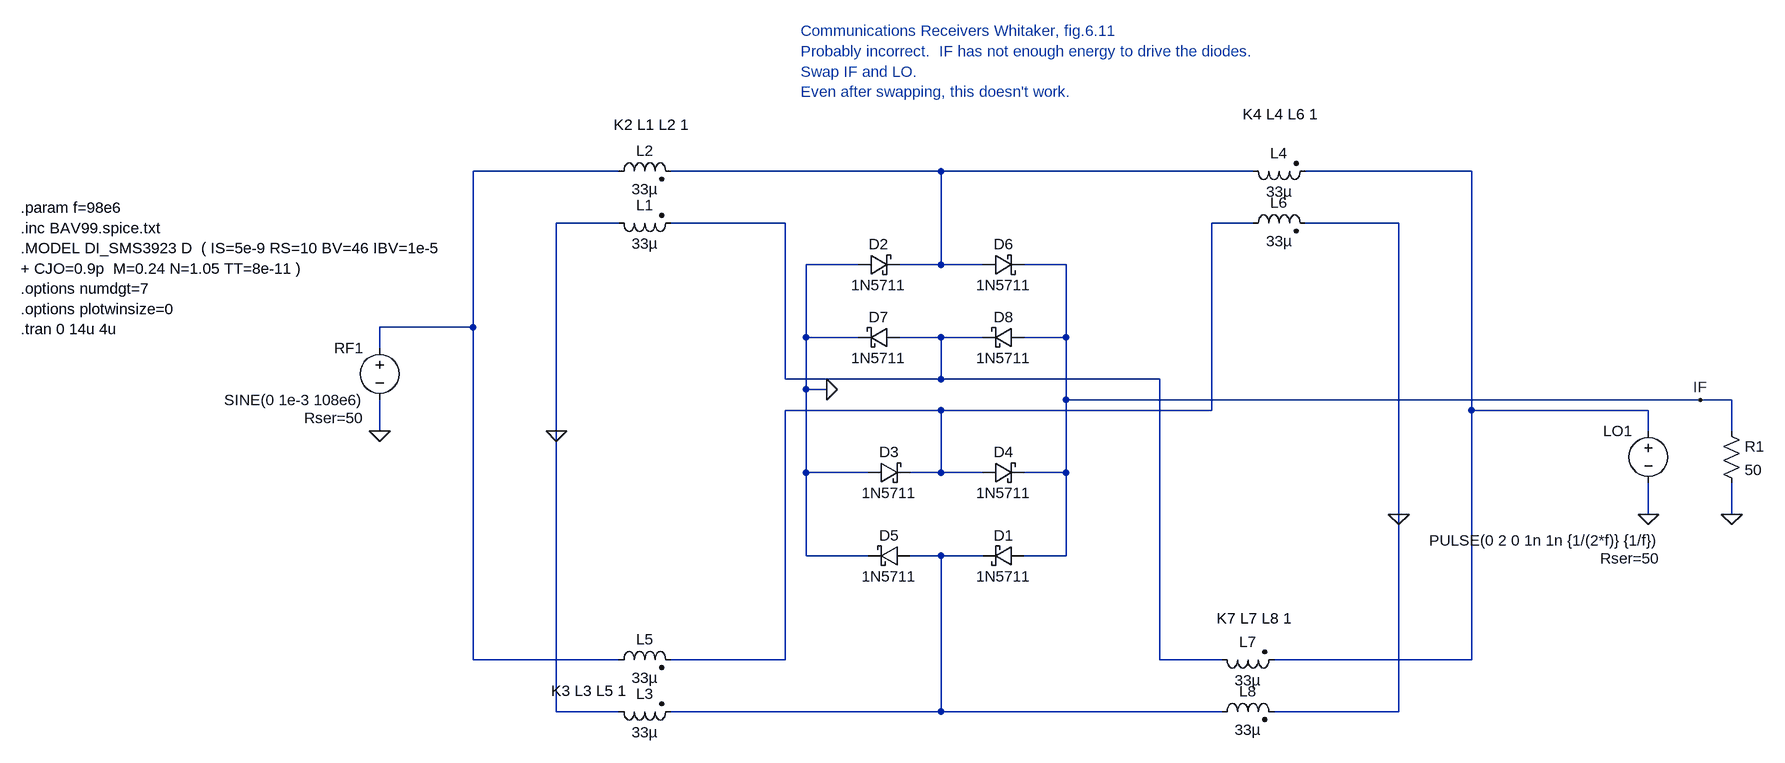
[diagram p0: schematic DDBM2.asc]
DDBM2.asc, the LTspice schematic file:
Version 4
SHEET 1 2308 852
WIRE -128 -272 -352 -272
WIRE 368 -272 -48 -272
WIRE 848 -272 368 -272
WIRE 1184 -272 928 -272
WIRE -128 -192 -224 -192
WIRE 128 -192 -48 -192
WIRE 848 -192 784 -192
WIRE 1072 -192 928 -192
WIRE 240 -128 160 -128
WIRE 368 -128 368 -272
WIRE 368 -128 304 -128
WIRE 432 -128 368 -128
WIRE 560 -128 496 -128
WIRE -352 -32 -352 -272
WIRE -352 -32 -496 -32
WIRE 160 -16 160 -128
WIRE 240 -16 160 -16
WIRE 368 -16 304 -16
WIRE 432 -16 368 -16
WIRE 560 -16 560 -128
WIRE 560 -16 496 -16
WIRE -496 0 -496 -32
WIRE 128 48 128 -192
WIRE 368 48 368 -16
WIRE 368 48 128 48
WIRE 704 48 368 48
WIRE 160 64 160 -16
WIRE 192 64 160 64
WIRE 560 80 560 -16
WIRE 1536 80 560 80
WIRE 1584 80 1536 80
WIRE 368 96 128 96
WIRE 784 96 784 -192
WIRE 784 96 368 96
WIRE 1184 96 1184 -272
WIRE 1456 96 1184 96
WIRE -496 128 -496 80
WIRE -224 128 -224 -192
WIRE 1456 128 1456 96
WIRE 1584 128 1584 80
WIRE 160 192 160 64
WIRE 256 192 160 192
WIRE 368 192 368 96
WIRE 368 192 320 192
WIRE 432 192 368 192
WIRE 560 192 560 80
WIRE 560 192 496 192
WIRE 1072 256 1072 -192
WIRE 1456 256 1456 208
WIRE 1584 256 1584 208
WIRE 160 320 160 192
WIRE 256 320 160 320
WIRE 368 320 320 320
WIRE 432 320 368 320
WIRE 560 320 560 192
WIRE 560 320 496 320
WIRE -352 480 -352 -32
WIRE -128 480 -352 480
WIRE 128 480 128 96
WIRE 128 480 -48 480
WIRE 704 480 704 48
WIRE 800 480 704 480
WIRE 1184 480 1184 96
WIRE 1184 480 880 480
WIRE -224 560 -224 128
WIRE -128 560 -224 560
WIRE 368 560 368 320
WIRE 368 560 -48 560
WIRE 800 560 368 560
WIRE 1072 560 1072 256
WIRE 1072 560 880 560
FLAG 1456 256 0
FLAG -496 128 0
FLAG 1072 256 0
FLAG -224 128 0
FLAG 192 64 0
FLAG 1584 256 0
FLAG 1536 80 IF
SYMBOL voltage 1456 112 M0
WINDOW 3 -18 184 Left 2
WINDOW 123 0 0 Left 0
WINDOW 39 -18 212 Left 2
SYMATTR Value PULSE(0 2 0 1n 1n {1/(2*f)} {1/f})
SYMATTR SpiceLine Rser=50
SYMATTR InstName LO1
SYMBOL ind2 -144 -208 M90
WINDOW 0 4 56 VBottom 2
WINDOW 3 32 56 VTop 2
SYMATTR InstName L1
SYMATTR Value 33µ
SYMATTR Type ind
SYMATTR SpiceLine Rser=0.0001
SYMBOL ind2 -144 -256 R270
WINDOW 0 32 56 VTop 2
WINDOW 3 4 56 VBottom 2
SYMATTR InstName L2
SYMATTR Value 33µ
SYMATTR Type ind
SYMATTR SpiceLine Rser=0.0001
SYMBOL ind2 832 -288 M90
WINDOW 0 4 56 VBottom 2
WINDOW 3 32 56 VTop 2
SYMATTR InstName L4
SYMATTR Value 33µ
SYMATTR Type ind
SYMBOL ind2 832 -176 R270
WINDOW 0 32 56 VTop 2
WINDOW 3 4 56 VBottom 2
SYMATTR InstName L6
SYMATTR Value 33µ
SYMATTR Type ind
SYMBOL schottky 496 304 R90
WINDOW 0 0 32 VBottom 2
WINDOW 3 32 32 VTop 2
SYMATTR InstName D1
SYMATTR Value 1N5711
SYMATTR Description Diode
SYMATTR Type diode
SYMBOL voltage -496 -16 M0
WINDOW 123 0 0 Left 0
WINDOW 39 24 124 Left 2
SYMATTR SpiceLine Rser=50
SYMATTR InstName RF1
SYMATTR Value SINE(0 1e-3 108e6)
SYMBOL schottky 240 -112 R270
WINDOW 0 32 32 VTop 2
WINDOW 3 0 32 VBottom 2
SYMATTR InstName D2
SYMATTR Value 1N5711
SYMATTR Description Diode
SYMATTR Type diode
SYMBOL schottky 256 208 R270
WINDOW 0 32 32 VTop 2
WINDOW 3 0 32 VBottom 2
SYMATTR InstName D3
SYMATTR Value 1N5711
SYMATTR Description Diode
SYMATTR Type diode
SYMBOL schottky 432 208 R270
WINDOW 0 32 32 VTop 2
WINDOW 3 0 32 VBottom 2
SYMATTR InstName D4
SYMATTR Value 1N5711
SYMATTR Description Diode
SYMATTR Type diode
SYMBOL ind2 -144 544 M90
WINDOW 0 4 56 VBottom 2
WINDOW 3 32 56 VTop 2
SYMATTR InstName L3
SYMATTR Value 33µ
SYMATTR Type ind
SYMATTR SpiceLine Rser=0.0001
SYMBOL ind2 -144 496 R270
WINDOW 0 32 56 VTop 2
WINDOW 3 4 56 VBottom 2
SYMATTR InstName L5
SYMATTR Value 33µ
SYMATTR Type ind
SYMBOL ind2 784 464 M90
WINDOW 0 4 56 VBottom 2
WINDOW 3 32 56 VTop 2
SYMATTR InstName L7
SYMATTR Value 33µ
SYMATTR Type ind
SYMBOL ind2 784 576 R270
WINDOW 0 32 56 VTop 2
WINDOW 3 4 56 VBottom 2
SYMATTR InstName L8
SYMATTR Value 33µ
SYMATTR Type ind
SYMATTR SpiceLine Rser=0.0001
SYMBOL schottky 320 336 M270
WINDOW 0 32 32 VTop 2
WINDOW 3 0 32 VBottom 2
SYMATTR InstName D5
SYMATTR Value 1N5711
SYMATTR Description Diode
SYMATTR Type diode
SYMBOL schottky 432 -144 M90
WINDOW 0 0 32 VBottom 2
WINDOW 3 32 32 VTop 2
SYMATTR InstName D6
SYMATTR Value 1N5711
SYMATTR Description Diode
SYMATTR Type diode
SYMBOL schottky 304 0 M270
WINDOW 0 32 32 VTop 2
WINDOW 3 0 32 VBottom 2
SYMATTR InstName D7
SYMATTR Value 1N5711
SYMATTR Description Diode
SYMATTR Type diode
SYMBOL schottky 496 0 M270
WINDOW 0 32 32 VTop 2
WINDOW 3 0 32 VBottom 2
SYMATTR InstName D8
SYMATTR Value 1N5711
SYMATTR Description Diode
SYMATTR Type diode
SYMBOL res 1568 112 R0
SYMATTR InstName R1
SYMATTR Value 50
TEXT -1048 -216 Left 2 !.param f=98e6\n.inc BAV99.spice.txt\n.MODEL DI_SMS3923 D  ( IS=5e-9 RS=10 BV=46 IBV=1e-5\n+ CJO=0.9p  M=0.24 N=1.05 TT=8e-11 )\n.options numdgt=7\n.options plotwinsize=0\n.tran 0 14u 4u
TEXT -232 528 Left 2 !K3 L3 L5 1
TEXT 832 -360 Left 2 !K4 L4 L6 1
TEXT 792 416 Left 2 !K7 L7 L8 1
TEXT -136 -344 Left 2 !K2 L1 L2 1
TEXT 152 -488 Left 2 ;Communications Receivers Whitaker, fig.6.11\nProbably incorrect.  IF has not enough energy to drive the diodes.\nSwap IF and LO.\nEven after swapping, this doesn't work.

The netlist it stands for:
* DDBM2.asc
V§LO1 N003 0 PULSE(0 2 0 1n 1n {1/(2*f)} {1/f}) Rser=50
L1 0 N004 33µ Rser=0.0001
L2 N001 N002 33µ Rser=0.0001
L4 N002 N003 33µ
L6 N005 0 33µ
D1 IF N006 1N5711
V§RF1 N001 0 SINE(0 1e-3 108e6) Rser=50
D2 0 N002 1N5711
D3 0 N005 1N5711
D4 N005 IF 1N5711
L3 0 N006 33µ Rser=0.0001
L5 N001 N005 33µ
L7 N004 N003 33µ
L8 N006 0 33µ Rser=0.0001
D5 N006 0 1N5711
D6 N002 IF 1N5711
D7 N004 0 1N5711
D8 IF N004 1N5711
R1 IF 0 50
.model D D
.lib standard.dio
.param f=98e6
.inc BAV99.spice.txt
.MODEL DI_SMS3923 D  ( IS=5e-9 RS=10 BV=46 IBV=1e-5
+ CJO=0.9p  M=0.24 N=1.05 TT=8e-11 )
.options numdgt=7
.options plotwinsize=0
.tran 0 14u 4u
K3 L3 L5 1
K4 L4 L6 1
K7 L7 L8 1
K2 L1 L2 1
* Communications Receivers Whitaker, fig.6.11
* Probably incorrect.  IF has not enough energy to drive the diodes.
* Swap IF and LO.
* Even after swapping, this doesn't work.
.backanno
.end